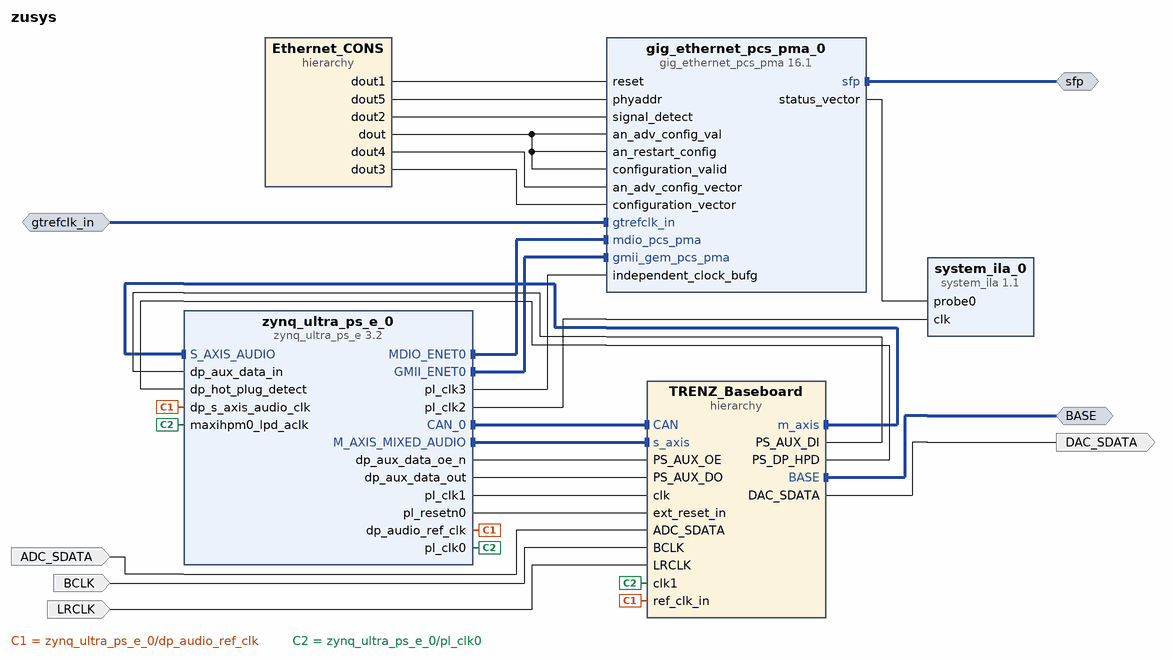
[diagram p0: block diagram of the top level]
# Vivado block design zusys, xczu15eg-ffvc900-1-e, Vivado 2018.2
create_bd_design zusys

create_bd_intf_port -mode Master -vlnv xilinx.com:user:SC0808BF_bus_rtl:1.0 BASE
create_bd_intf_port -mode Slave -vlnv xilinx.com:interface:diff_clock_rtl:1.0 gtrefclk_in
create_bd_intf_port -mode Master -vlnv xilinx.com:interface:sfp_rtl:1.0 sfp
create_bd_port -dir I ADC_SDATA
create_bd_port -dir I BCLK
create_bd_port -dir I LRCLK
create_bd_port -dir O DAC_SDATA

create_bd_cell -type ip -vlnv xilinx.com:ip:zynq_ultra_ps_e:3.2 zynq_ultra_ps_e_0
set_property -dict [list \
  CONFIG.PSU__PSS_REF_CLK__FREQMHZ 33.33333 \
  CONFIG.PSU__CAN0__PERIPHERAL__ENABLE 1 \
  CONFIG.PSU__CAN0__PERIPHERAL__IO EMIO \
  CONFIG.PSU__DPAUX__PERIPHERAL__ENABLE 1 \
  CONFIG.PSU__DPAUX__PERIPHERAL__IO EMIO \
  CONFIG.PSU__ENET0__GRP_MDIO__ENABLE 1 \
  CONFIG.PSU__ENET0__GRP_MDIO__IO EMIO \
  CONFIG.PSU__GEM__TSU__ENABLE 0 \
  CONFIG.PSU__ENET0__PERIPHERAL__ENABLE 1 \
  CONFIG.PSU__ENET0__PERIPHERAL__IO EMIO \
  CONFIG.PSU__FPGA_PL1_ENABLE 1 \
  CONFIG.PSU__FPGA_PL2_ENABLE 1 \
  CONFIG.PSU__FPGA_PL3_ENABLE 1 \
  CONFIG.PSU__ENET3__PERIPHERAL__ENABLE 0 \
  CONFIG.PSU__GPIO0_MIO__PERIPHERAL__ENABLE 1 \
  CONFIG.PSU__GPIO0_MIO__IO {MIO 0 .. 25} \
  CONFIG.PSU__I2C0__PERIPHERAL__ENABLE 1 \
  CONFIG.PSU__I2C0__PERIPHERAL__IO {MIO 38 .. 39} \
  CONFIG.PSU__PCIE__PERIPHERAL__ENABLE 1 \
  CONFIG.PSU__PCIE__PERIPHERAL__ENDPOINT_ENABLE 0 \
  CONFIG.PSU__PCIE__PERIPHERAL__ROOTPORT_ENABLE 1 \
  CONFIG.PSU__PCIE__PERIPHERAL__ROOTPORT_IO {MIO 31} \
  CONFIG.PSU__PCIE__LANE0__ENABLE 1 \
  CONFIG.PSU__PCIE__LANE0__IO {GT Lane0} \
  CONFIG.PSU__GT__LINK_SPEED HBR \
  CONFIG.PSU__GT__VLT_SWNG_LVL_4 0 \
  CONFIG.PSU__GT__PRE_EMPH_LVL_4 0 \
  CONFIG.PSU__USB0__REF_CLK_SEL {Ref Clk2} \
  CONFIG.PSU__USB0__REF_CLK_FREQ 100 \
  CONFIG.PSU__DP__REF_CLK_SEL {Ref Clk3} \
  CONFIG.PSU__DP__REF_CLK_FREQ 27 \
  CONFIG.PSU__SATA__REF_CLK_SEL {Ref Clk1} \
  CONFIG.PSU__SATA__REF_CLK_FREQ 150 \
  CONFIG.PSU__PCIE__REF_CLK_SEL {Ref Clk2} \
  CONFIG.PSU__PCIE__REF_CLK_FREQ 100 \
  CONFIG.PSU__DP__LANE_SEL {Single Higher} \
  CONFIG.PSU__PCIE__DEVICE_PORT_TYPE {Root Port} \
  CONFIG.PSU__PCIE__MAXIMUM_LINK_WIDTH x1 \
  CONFIG.PSU__PCIE__LINK_SPEED {5.0 Gb/s} \
  CONFIG.PSU__PCIE__BAR0_VAL 0x0 \
  CONFIG.PSU__PCIE__BAR1_VAL 0x0 \
  CONFIG.PSU__PCIE__BAR2_VAL 0x0 \
  CONFIG.PSU__PCIE__BAR3_VAL 0x0 \
  CONFIG.PSU__PCIE__BAR4_VAL 0x0 \
  CONFIG.PSU__PCIE__BAR5_VAL 0x0 \
  CONFIG.PSU__PCIE__EROM_VAL 0x0 \
  CONFIG.PSU__PCIE__MAX_PAYLOAD_SIZE {256 bytes} \
  CONFIG.PSU__PCIE__VENDOR_ID 0x10EE \
  CONFIG.PSU__PCIE__DEVICE_ID 0xD021 \
  CONFIG.PSU__PCIE__REVISION_ID 0x0 \
  CONFIG.PSU__PCIE__SUBSYSTEM_VENDOR_ID 0x10EE \
  CONFIG.PSU__PCIE__SUBSYSTEM_ID 0x7 \
  CONFIG.PSU__PCIE__CLASS_CODE_BASE 0x06 \
  CONFIG.PSU__PCIE__CLASS_CODE_SUB 0x04 \
  CONFIG.PSU__PCIE__CLASS_CODE_INTERFACE 0x0 \
  CONFIG.PSU__PCIE__CLASS_CODE_VALUE 0x60400 \
  CONFIG.SUBPRESET1 Custom \
  CONFIG.PSU__PJTAG__PERIPHERAL__ENABLE 1 \
  CONFIG.PSU__PJTAG__PERIPHERAL__IO {MIO 26 .. 29} \
  CONFIG.PSU__QSPI__PERIPHERAL__ENABLE 1 \
  CONFIG.PSU__QSPI__PERIPHERAL__IO {MIO 0 .. 12} \
  CONFIG.PSU__QSPI__PERIPHERAL__MODE {Dual Parallel} \
  CONFIG.PSU__QSPI__PERIPHERAL__DATA_MODE x4 \
  CONFIG.PSU__QSPI__GRP_FBCLK__ENABLE 1 \
  CONFIG.PSU__QSPI__GRP_FBCLK__IO {MIO 6} \
  CONFIG.PSU__SD0__PERIPHERAL__ENABLE 1 \
  CONFIG.PSU__SD0__PERIPHERAL__IO {MIO 13 .. 22} \
  CONFIG.PSU__SD0__GRP_POW__ENABLE 1 \
  CONFIG.PSU__SD0__GRP_POW__IO {MIO 23} \
  CONFIG.PSU__SD0__SLOT_TYPE eMMC \
  CONFIG.PSU__SD0__RESET__ENABLE 1 \
  CONFIG.PSU__SD0__DATA_TRANSFER_MODE 8Bit \
  CONFIG.PSU__SD1__PERIPHERAL__ENABLE 1 \
  CONFIG.PSU__SD1__PERIPHERAL__IO {MIO 46 .. 51} \
  CONFIG.PSU__SD1__GRP_CD__ENABLE 1 \
  CONFIG.PSU__SD1__GRP_CD__IO {MIO 45} \
  CONFIG.PSU__SD1__GRP_POW__ENABLE 0 \
  CONFIG.PSU__SD1__GRP_WP__ENABLE 1 \
  CONFIG.PSU__SD1__GRP_WP__IO {MIO 44} \
  CONFIG.PSU__SD1__SLOT_TYPE {SD 2.0} \
  CONFIG.PSU__SD1__DATA_TRANSFER_MODE 4Bit \
  CONFIG.PSU__SWDT0__PERIPHERAL__ENABLE 1 \
  CONFIG.PSU__SWDT0__CLOCK__ENABLE 0 \
  CONFIG.PSU__SWDT0__RESET__ENABLE 0 \
  CONFIG.PSU__SWDT1__PERIPHERAL__ENABLE 1 \
  CONFIG.PSU__SWDT1__CLOCK__ENABLE 0 \
  CONFIG.PSU__SWDT1__RESET__ENABLE 0 \
  CONFIG.PSU__UART0__BAUD_RATE 115200 \
  CONFIG.PSU__TTC0__PERIPHERAL__ENABLE 1 \
  CONFIG.PSU__TTC0__CLOCK__ENABLE 0 \
  CONFIG.PSU__TTC0__WAVEOUT__ENABLE 0 \
  CONFIG.PSU__TTC1__PERIPHERAL__ENABLE 1 \
  CONFIG.PSU__TTC1__CLOCK__ENABLE 0 \
  CONFIG.PSU__TTC1__WAVEOUT__ENABLE 0 \
  CONFIG.PSU__TTC2__PERIPHERAL__ENABLE 1 \
  CONFIG.PSU__TTC2__CLOCK__ENABLE 0 \
  CONFIG.PSU__TTC2__WAVEOUT__ENABLE 0 \
  CONFIG.PSU__TTC3__PERIPHERAL__ENABLE 1 \
  CONFIG.PSU__TTC3__CLOCK__ENABLE 0 \
  CONFIG.PSU__TTC3__WAVEOUT__ENABLE 0 \
  CONFIG.PSU__DDRC__DEVICE_CAPACITY {8192 MBits} \
  CONFIG.PSU__DDRC__DRAM_WIDTH {16 Bits} \
  CONFIG.PSU__DDRC__SPEED_BIN DDR4_2400P \
  CONFIG.PSU__UART0__PERIPHERAL__ENABLE 1 \
  CONFIG.PSU__UART0__PERIPHERAL__IO {MIO 42 .. 43} \
  CONFIG.PSU__UART0__MODEM__ENABLE 0 \
  CONFIG.PSU__USB0__PERIPHERAL__ENABLE 1 \
  CONFIG.PSU__USB0__PERIPHERAL__IO {MIO 52 .. 63} \
  CONFIG.PSU__USB3_0__PERIPHERAL__ENABLE 1 \
  CONFIG.PSU__USB3_0__PERIPHERAL__IO {GT Lane1} \
  CONFIG.PSU__USB3_0__EMIO__ENABLE 0 \
  CONFIG.PSU__USB2_0__EMIO__ENABLE 0 \
  CONFIG.PSU__USE__AUDIO 1 \
  CONFIG.PSU__DDR_HIGH_ADDRESS_GUI_ENABLE 1 \
  CONFIG.PSU_BANK_0_IO_STANDARD LVCMOS18 \
  CONFIG.PSU_BANK_1_IO_STANDARD LVCMOS18 \
  CONFIG.PSU_BANK_2_IO_STANDARD LVCMOS18 \
  CONFIG.PSU_BANK_3_IO_STANDARD LVCMOS18 \
  CONFIG.PSU__DISPLAYPORT__PERIPHERAL__ENABLE 1 \
  CONFIG.PSU__DISPLAYPORT__LANE0__ENABLE 1 \
  CONFIG.PSU__DISPLAYPORT__LANE0__IO {GT Lane3} \
  CONFIG.PSU__DISPLAYPORT__LANE1__ENABLE 0 \
  CONFIG.PSU__SATA__PERIPHERAL__ENABLE 1 \
  CONFIG.PSU__SATA__LANE0__ENABLE 1 \
  CONFIG.PSU__SATA__LANE0__IO {GT Lane2} \
  CONFIG.PSU__SATA__LANE1__ENABLE 0 \
  CONFIG.PSU__CRL_APB__USB3__ENABLE 1 \
  CONFIG.PSU__CRF_APB__DP_VIDEO_REF_CTRL__SRCSEL VPLL \
  CONFIG.PSU__CRF_APB__DP_AUDIO_REF_CTRL__SRCSEL RPLL \
  CONFIG.PSU__CRF_APB__DP_STC_REF_CTRL__SRCSEL RPLL \
  CONFIG.PSU__CRL_APB__PL0_REF_CTRL__SRCSEL IOPLL \
  CONFIG.PSU__CRL_APB__PL1_REF_CTRL__SRCSEL IOPLL \
  CONFIG.PSU__CRF_APB__TOPSW_MAIN_CTRL__SRCSEL APLL \
  CONFIG.PSU__CRL_APB__SDIO0_REF_CTRL__SRCSEL IOPLL \
  CONFIG.PSU__CRL_APB__SDIO1_REF_CTRL__SRCSEL IOPLL \
  CONFIG.PSU__CRL_APB__CPU_R5_CTRL__SRCSEL IOPLL \
  CONFIG.PSU__CRL_APB__IOU_SWITCH_CTRL__SRCSEL IOPLL \
  CONFIG.PSU__CRL_APB__LPD_SWITCH_CTRL__SRCSEL IOPLL \
  CONFIG.PSU__CRL_APB__ADMA_REF_CTRL__SRCSEL IOPLL \
  CONFIG.PSU__DLL__ISUSED 1 \
  CONFIG.PSU__DDR__INTERFACE__FREQMHZ 600.000 \
  CONFIG.PSU__CRF_APB__DDR_CTRL__FREQMHZ 1200 \
  CONFIG.PSU__CRL_APB__PL1_REF_CTRL__FREQMHZ 25 \
  CONFIG.PSU__CRL_APB__PL2_REF_CTRL__FREQMHZ 200 \
  CONFIG.PSU__CRL_APB__PL3_REF_CTRL__FREQMHZ 50 \
  CONFIG.PSU__USB0_COHERENCY 0 \
  CONFIG.PSU__SD1_COHERENCY 0 \
  CONFIG.PSU__QSPI_COHERENCY 0 \
] [get_bd_cells zynq_ultra_ps_e_0]
# 139 more settings of zynq_ultra_ps_e_0 are not shown: defaults, MIO pin electricals, DDR timing, and values the tool derives
create_bd_cell -type ip -vlnv xilinx.com:ip:gig_ethernet_pcs_pma:16.1 gig_ethernet_pcs_pma_0
set_property -dict [list \
  CONFIG.Standard 1000BASEX \
  CONFIG.Auto_Negotiation true \
  CONFIG.EMAC_IF_TEMAC GEM \
  CONFIG.SupportLevel Include_Shared_Logic_in_Core \
  CONFIG.GTinEx false \
  CONFIG.GT_Location X1Y15 \
] [get_bd_cells gig_ethernet_pcs_pma_0]
create_bd_cell -type hier Ethernet_CONS
create_bd_cell -type hier TRENZ_Baseboard
create_bd_cell -type ip -vlnv xilinx.com:ip:system_ila:1.1 system_ila_0
set_property -dict {CONFIG.C_PROBE0_TYPE 0 CONFIG.C_NUM_OF_PROBES 1 CONFIG.C_MON_TYPE NATIVE} [get_bd_cells system_ila_0]

# ---- hierarchy /Ethernet_CONS ----
current_bd_instance /Ethernet_CONS
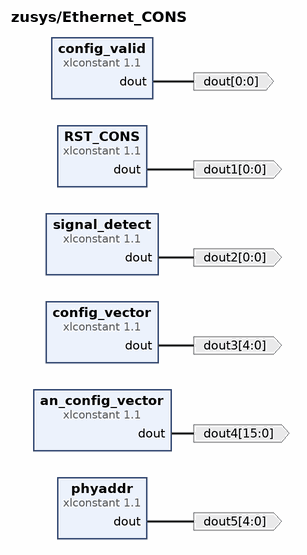
[diagram p1: block diagram inside /Ethernet_CONS]
create_bd_pin -dir O -from 0 -to 0 dout
create_bd_pin -dir O -from 0 -to 0 dout1
create_bd_pin -dir O -from 0 -to 0 dout2
create_bd_pin -dir O -from 4 -to 0 dout3
create_bd_pin -dir O -from 15 -to 0 dout4
create_bd_pin -dir O -from 4 -to 0 dout5

create_bd_cell -type ip -vlnv xilinx.com:ip:xlconstant:1.1 config_valid
set_property -dict {CONFIG.CONST_WIDTH 1 CONFIG.CONST_VAL 0} [get_bd_cells config_valid]
create_bd_cell -type ip -vlnv xilinx.com:ip:xlconstant:1.1 RST_CONS
set_property -dict {CONFIG.CONST_WIDTH 1 CONFIG.CONST_VAL 0} [get_bd_cells RST_CONS]
create_bd_cell -type ip -vlnv xilinx.com:ip:xlconstant:1.1 signal_detect
set_property -dict {CONFIG.CONST_WIDTH 1 CONFIG.CONST_VAL 1} [get_bd_cells signal_detect]
create_bd_cell -type ip -vlnv xilinx.com:ip:xlconstant:1.1 config_vector
set_property -dict {CONFIG.CONST_WIDTH 5 CONFIG.CONST_VAL 0} [get_bd_cells config_vector]
create_bd_cell -type ip -vlnv xilinx.com:ip:xlconstant:1.1 an_config_vector
set_property -dict {CONFIG.CONST_WIDTH 16 CONFIG.CONST_VAL b100001} [get_bd_cells an_config_vector]
create_bd_cell -type ip -vlnv xilinx.com:ip:xlconstant:1.1 phyaddr
set_property -dict {CONFIG.CONST_WIDTH 5 CONFIG.CONST_VAL 9} [get_bd_cells phyaddr]

# ---- hierarchy /TRENZ_Baseboard ----
current_bd_instance /TRENZ_Baseboard
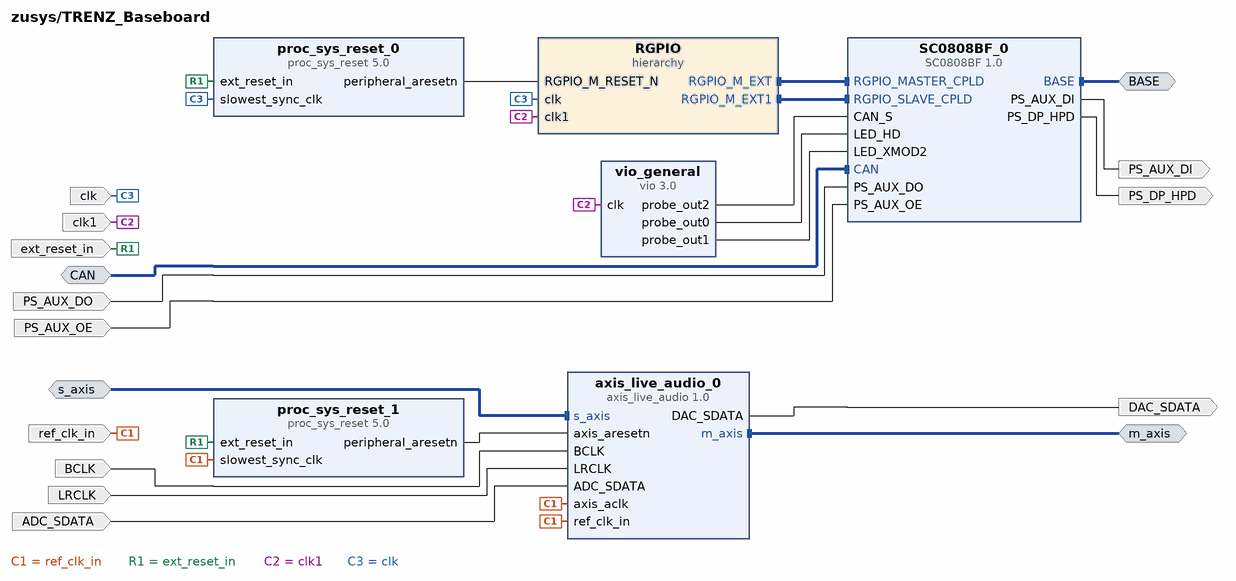
[diagram p2: block diagram inside /TRENZ_Baseboard]
create_bd_intf_pin -mode Master -vlnv xilinx.com:user:SC0808BF_bus_rtl:1.0 BASE
create_bd_intf_pin -mode MirroredMaster -vlnv xilinx.com:interface:can_rtl:1.0 CAN
create_bd_intf_pin -mode Slave -vlnv xilinx.com:interface:axis_rtl:1.0 s_axis
create_bd_intf_pin -mode Master -vlnv xilinx.com:interface:axis_rtl:1.0 m_axis
create_bd_pin -dir O PS_AUX_DI
create_bd_pin -dir I PS_AUX_DO
create_bd_pin -dir I PS_AUX_OE
create_bd_pin -dir O PS_DP_HPD
create_bd_pin -dir I ref_clk_in
create_bd_pin -dir I BCLK
create_bd_pin -dir I LRCLK
create_bd_pin -dir O DAC_SDATA
create_bd_pin -dir I ADC_SDATA
create_bd_pin -dir I -type rst ext_reset_in
create_bd_pin -dir I -type clk clk1
create_bd_pin -dir I -type clk clk

create_bd_cell -type ip -vlnv trenz.biz:user:SC0808BF:1.0 SC0808BF_0
create_bd_cell -type ip -vlnv trenz.biz:user:axis_live_audio:1.0 axis_live_audio_0
set_property -dict {CONFIG.C_USE_AUDIO_IN false CONFIG.C_USE_AUDIO_OUT true} [get_bd_cells axis_live_audio_0]
create_bd_cell -type ip -vlnv xilinx.com:ip:proc_sys_reset:5.0 proc_sys_reset_1
create_bd_cell -type ip -vlnv xilinx.com:ip:vio:3.0 vio_general
set_property -dict {CONFIG.C_NUM_PROBE_OUT 3 CONFIG.C_NUM_PROBE_IN 0} [get_bd_cells vio_general]
create_bd_cell -type ip -vlnv xilinx.com:ip:proc_sys_reset:5.0 proc_sys_reset_0
create_bd_cell -type hier RGPIO

# ---- hierarchy /TRENZ_Baseboard/RGPIO ----
current_bd_instance /TRENZ_Baseboard/RGPIO
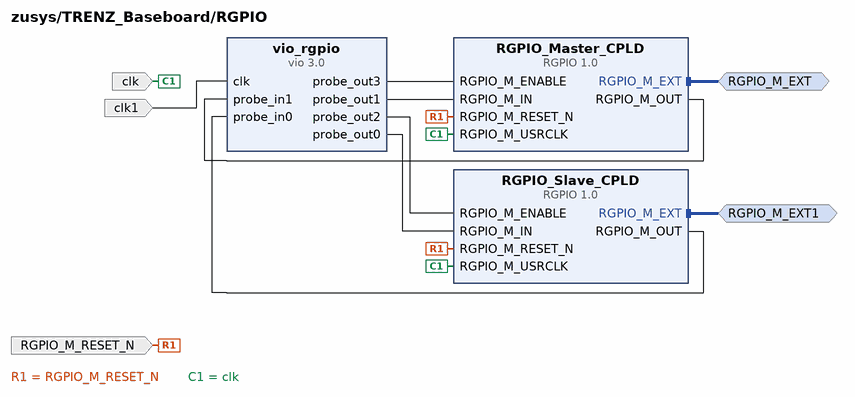
[diagram p3: block diagram inside /TRENZ_Baseboard/RGPIO]
create_bd_intf_pin -mode Master -vlnv trenz.local:user:RGPIO_EXT_rtl:1.0 RGPIO_M_EXT
create_bd_intf_pin -mode Master -vlnv trenz.local:user:RGPIO_EXT_rtl:1.0 RGPIO_M_EXT1
create_bd_pin -dir I -type rst RGPIO_M_RESET_N
create_bd_pin -dir I -type clk clk
create_bd_pin -dir I -type clk clk1

create_bd_cell -type ip -vlnv trenz.local:user:RGPIO:1.0 RGPIO_Master_CPLD
set_property -dict {CONFIG.C_TYP 0} [get_bd_cells RGPIO_Master_CPLD]
create_bd_cell -type ip -vlnv trenz.local:user:RGPIO:1.0 RGPIO_Slave_CPLD
set_property -dict {CONFIG.C_TYP 0} [get_bd_cells RGPIO_Slave_CPLD]
create_bd_cell -type ip -vlnv xilinx.com:ip:vio:3.0 vio_rgpio
set_property -dict [list \
  CONFIG.C_PROBE_OUT1_WIDTH 24 \
  CONFIG.C_PROBE_OUT0_WIDTH 24 \
  CONFIG.C_NUM_PROBE_OUT 4 \
  CONFIG.C_NUM_PROBE_IN 2 \
] [get_bd_cells vio_rgpio]

# ---- connections ----

current_bd_instance /Ethernet_CONS
connect_bd_net [get_bd_pins config_valid/dout] [get_bd_pins dout]
connect_bd_net [get_bd_pins RST_CONS/dout] [get_bd_pins dout1]
connect_bd_net [get_bd_pins signal_detect/dout] [get_bd_pins dout2]
connect_bd_net [get_bd_pins config_vector/dout] [get_bd_pins dout3]
connect_bd_net -net config_vector_dout [get_bd_pins an_config_vector/dout] [get_bd_pins dout4]
connect_bd_net [get_bd_pins phyaddr/dout] [get_bd_pins dout5]

current_bd_instance /TRENZ_Baseboard
connect_bd_intf_net -intf_net RGPIO_Master_CPLD_RGPIO_M_EXT [get_bd_intf_pins RGPIO/RGPIO_M_EXT] [get_bd_intf_pins SC0808BF_0/RGPIO_MASTER_CPLD]
connect_bd_intf_net -intf_net RGPIO_Slave_CPLD_RGPIO_M_EXT [get_bd_intf_pins RGPIO/RGPIO_M_EXT1] [get_bd_intf_pins SC0808BF_0/RGPIO_SLAVE_CPLD]
connect_bd_intf_net [get_bd_intf_pins BASE] [get_bd_intf_pins SC0808BF_0/BASE]
connect_bd_intf_net -intf_net zynq_ultra_ps_e_0_CAN_0 [get_bd_intf_pins CAN] [get_bd_intf_pins SC0808BF_0/CAN]
connect_bd_intf_net -intf_net zynq_ultra_ps_e_0_M_AXIS_MIXED_AUDIO [get_bd_intf_pins s_axis] [get_bd_intf_pins axis_live_audio_0/s_axis]
connect_bd_intf_net [get_bd_intf_pins m_axis] [get_bd_intf_pins axis_live_audio_0/m_axis]
connect_bd_net -net vio_CAN_0_S [get_bd_pins vio_general/probe_out2] [get_bd_pins SC0808BF_0/CAN_S]
connect_bd_net -net vio_LED_HD [get_bd_pins vio_general/probe_out0] [get_bd_pins SC0808BF_0/LED_HD]
connect_bd_net -net vio_LED_XMOD2 [get_bd_pins vio_general/probe_out1] [get_bd_pins SC0808BF_0/LED_XMOD2]
connect_bd_net [get_bd_pins proc_sys_reset_1/peripheral_aresetn] [get_bd_pins axis_live_audio_0/axis_aresetn]
connect_bd_net [get_bd_pins proc_sys_reset_0/peripheral_aresetn] [get_bd_pins RGPIO/RGPIO_M_RESET_N]
connect_bd_net [get_bd_pins SC0808BF_0/PS_AUX_DI] [get_bd_pins PS_AUX_DI]
connect_bd_net -net zynq_ultra_ps_e_0_dp_aux_data_out [get_bd_pins PS_AUX_DO] [get_bd_pins SC0808BF_0/PS_AUX_DO]
connect_bd_net -net zynq_ultra_ps_e_0_dp_aux_data_oe_n [get_bd_pins PS_AUX_OE] [get_bd_pins SC0808BF_0/PS_AUX_OE]
connect_bd_net [get_bd_pins SC0808BF_0/PS_DP_HPD] [get_bd_pins PS_DP_HPD]
connect_bd_net -net zynq_ultra_ps_e_0_dp_audio_ref_clk [get_bd_pins ref_clk_in] \
  [get_bd_pins axis_live_audio_0/ref_clk_in] [get_bd_pins proc_sys_reset_1/slowest_sync_clk] \
  [get_bd_pins axis_live_audio_0/axis_aclk]
connect_bd_net [get_bd_pins BCLK] [get_bd_pins axis_live_audio_0/BCLK]
connect_bd_net [get_bd_pins LRCLK] [get_bd_pins axis_live_audio_0/LRCLK]
connect_bd_net [get_bd_pins axis_live_audio_0/DAC_SDATA] [get_bd_pins DAC_SDATA]
connect_bd_net [get_bd_pins ADC_SDATA] [get_bd_pins axis_live_audio_0/ADC_SDATA]
connect_bd_net -net zynq_ultra_ps_e_0_pl_resetn0 [get_bd_pins ext_reset_in] \
  [get_bd_pins proc_sys_reset_0/ext_reset_in] [get_bd_pins proc_sys_reset_1/ext_reset_in]
connect_bd_net -net zynq_ultra_ps_e_0_pl_clk1 [get_bd_pins clk1] [get_bd_pins vio_general/clk] [get_bd_pins RGPIO/clk1]
connect_bd_net -net zynq_ultra_ps_e_0_pl_clk0 [get_bd_pins clk] [get_bd_pins proc_sys_reset_0/slowest_sync_clk] [get_bd_pins RGPIO/clk]

current_bd_instance /TRENZ_Baseboard/RGPIO
connect_bd_intf_net [get_bd_intf_pins RGPIO_M_EXT] [get_bd_intf_pins RGPIO_Master_CPLD/RGPIO_M_EXT]
connect_bd_intf_net [get_bd_intf_pins RGPIO_M_EXT1] [get_bd_intf_pins RGPIO_Slave_CPLD/RGPIO_M_EXT]
connect_bd_net -net RGPIO_MASTER_CPLD_ENABLE [get_bd_pins vio_rgpio/probe_out3] [get_bd_pins RGPIO_Master_CPLD/RGPIO_M_ENABLE]
connect_bd_net -net RGPIO_MASTER_CPLD_RX [get_bd_pins RGPIO_Master_CPLD/RGPIO_M_OUT] [get_bd_pins vio_rgpio/probe_in1]
connect_bd_net -net RGPIO_MASTER_CPLD_TX [get_bd_pins vio_rgpio/probe_out1] [get_bd_pins RGPIO_Master_CPLD/RGPIO_M_IN]
connect_bd_net -net RGPIO_SLAVE_CPLD_ENABLE [get_bd_pins vio_rgpio/probe_out2] [get_bd_pins RGPIO_Slave_CPLD/RGPIO_M_ENABLE]
connect_bd_net -net RGPIO_SLAVE_CPLD_RX [get_bd_pins RGPIO_Slave_CPLD/RGPIO_M_OUT] [get_bd_pins vio_rgpio/probe_in0]
connect_bd_net -net RGPIO_SLAVE_CPLD_TX [get_bd_pins vio_rgpio/probe_out0] [get_bd_pins RGPIO_Slave_CPLD/RGPIO_M_IN]
connect_bd_net -net clk1_1 [get_bd_pins clk1] [get_bd_pins vio_rgpio/clk]
connect_bd_net -net proc_sys_reset_0_peripheral_aresetn [get_bd_pins RGPIO_M_RESET_N] \
  [get_bd_pins RGPIO_Master_CPLD/RGPIO_M_RESET_N] [get_bd_pins RGPIO_Slave_CPLD/RGPIO_M_RESET_N]
connect_bd_net -net zynq_ultra_ps_e_0_pl_clk0 [get_bd_pins clk] \
  [get_bd_pins RGPIO_Master_CPLD/RGPIO_M_USRCLK] [get_bd_pins RGPIO_Slave_CPLD/RGPIO_M_USRCLK]

current_bd_instance /
connect_bd_intf_net -intf_net axis_live_audio_0_m_axis [get_bd_intf_pins TRENZ_Baseboard/m_axis] [get_bd_intf_pins zynq_ultra_ps_e_0/S_AXIS_AUDIO]
connect_bd_intf_net [get_bd_intf_pins TRENZ_Baseboard/CAN] [get_bd_intf_pins zynq_ultra_ps_e_0/CAN_0]
connect_bd_intf_net [get_bd_intf_pins TRENZ_Baseboard/s_axis] [get_bd_intf_pins zynq_ultra_ps_e_0/M_AXIS_MIXED_AUDIO]
connect_bd_intf_net [get_bd_intf_pins zynq_ultra_ps_e_0/MDIO_ENET0] [get_bd_intf_pins gig_ethernet_pcs_pma_0/mdio_pcs_pma]
connect_bd_intf_net [get_bd_intf_pins zynq_ultra_ps_e_0/GMII_ENET0] [get_bd_intf_pins gig_ethernet_pcs_pma_0/gmii_gem_pcs_pma]
connect_bd_intf_net -intf_net SC0808BF_0_BASE [get_bd_intf_ports BASE] [get_bd_intf_pins TRENZ_Baseboard/BASE]
connect_bd_intf_net -intf_net gtrefclk_in_0_1 [get_bd_intf_ports gtrefclk_in] [get_bd_intf_pins gig_ethernet_pcs_pma_0/gtrefclk_in]
connect_bd_intf_net [get_bd_intf_ports sfp] [get_bd_intf_pins gig_ethernet_pcs_pma_0/sfp]
connect_bd_net [get_bd_ports ADC_SDATA] [get_bd_pins TRENZ_Baseboard/ADC_SDATA]
connect_bd_net [get_bd_ports BCLK] [get_bd_pins TRENZ_Baseboard/BCLK]
connect_bd_net [get_bd_ports LRCLK] [get_bd_pins TRENZ_Baseboard/LRCLK]
connect_bd_net -net SC0808BF_0_PS_AUX_DI [get_bd_pins TRENZ_Baseboard/PS_AUX_DI] [get_bd_pins zynq_ultra_ps_e_0/dp_aux_data_in]
connect_bd_net -net SC0808BF_0_PS_DP_HPD [get_bd_pins TRENZ_Baseboard/PS_DP_HPD] [get_bd_pins zynq_ultra_ps_e_0/dp_hot_plug_detect]
connect_bd_net -net axis_live_audio_0_DAC_SDATA [get_bd_pins TRENZ_Baseboard/DAC_SDATA] [get_bd_ports DAC_SDATA]
connect_bd_net [get_bd_pins zynq_ultra_ps_e_0/dp_audio_ref_clk] \
  [get_bd_pins zynq_ultra_ps_e_0/dp_s_axis_audio_clk] [get_bd_pins TRENZ_Baseboard/ref_clk_in]
connect_bd_net [get_bd_pins zynq_ultra_ps_e_0/dp_aux_data_oe_n] [get_bd_pins TRENZ_Baseboard/PS_AUX_OE]
connect_bd_net [get_bd_pins zynq_ultra_ps_e_0/dp_aux_data_out] [get_bd_pins TRENZ_Baseboard/PS_AUX_DO]
connect_bd_net [get_bd_pins zynq_ultra_ps_e_0/pl_clk1] [get_bd_pins TRENZ_Baseboard/clk]
connect_bd_net [get_bd_pins zynq_ultra_ps_e_0/pl_clk0] [get_bd_pins zynq_ultra_ps_e_0/maxihpm0_lpd_aclk] [get_bd_pins TRENZ_Baseboard/clk1]
connect_bd_net [get_bd_pins zynq_ultra_ps_e_0/pl_resetn0] [get_bd_pins TRENZ_Baseboard/ext_reset_in]
connect_bd_net -net RST_CONS_dout [get_bd_pins Ethernet_CONS/dout1] [get_bd_pins gig_ethernet_pcs_pma_0/reset]
connect_bd_net -net phyaddr_dout [get_bd_pins Ethernet_CONS/dout5] [get_bd_pins gig_ethernet_pcs_pma_0/phyaddr]
connect_bd_net -net signal_detect_dout [get_bd_pins Ethernet_CONS/dout2] [get_bd_pins gig_ethernet_pcs_pma_0/signal_detect]
connect_bd_net -net config_valid_dout [get_bd_pins Ethernet_CONS/dout] \
  [get_bd_pins gig_ethernet_pcs_pma_0/an_restart_config] [get_bd_pins gig_ethernet_pcs_pma_0/configuration_valid] \
  [get_bd_pins gig_ethernet_pcs_pma_0/an_adv_config_val]
connect_bd_net -net config_vector_dout [get_bd_pins Ethernet_CONS/dout4] [get_bd_pins gig_ethernet_pcs_pma_0/an_adv_config_vector]
connect_bd_net -net config_vector_dout1 [get_bd_pins Ethernet_CONS/dout3] [get_bd_pins gig_ethernet_pcs_pma_0/configuration_vector]
connect_bd_net -net status_vector [get_bd_pins gig_ethernet_pcs_pma_0/status_vector] [get_bd_pins system_ila_0/probe0]
connect_bd_net [get_bd_pins zynq_ultra_ps_e_0/pl_clk2] [get_bd_pins system_ila_0/clk]
connect_bd_net [get_bd_pins zynq_ultra_ps_e_0/pl_clk3] [get_bd_pins gig_ethernet_pcs_pma_0/independent_clock_bufg]

validate_bd_design
save_bd_design
